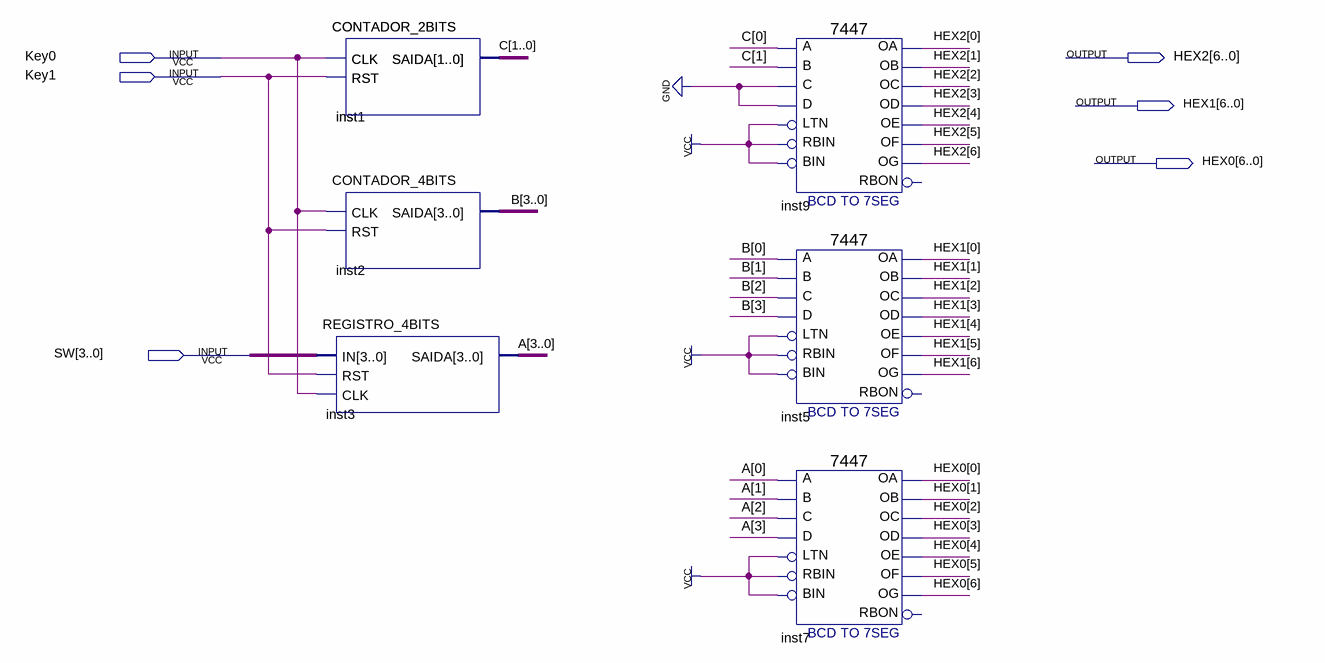
[diagram p0: schematic sheet]
// Quartus schematic TESTE_FINAL.bdf as structural Verilog: 7 symbols, 6 pins
module TESTE_FINAL (
  input  Key0,
  input  Key1,
  input  [3:0] SW,
  output [6:0] HEX2,
  output [6:0] HEX1,
  output [6:0] HEX0
);

  wire [1:0] C;
  wire [3:0] A, B;

  REGISTRO_4BITS inst3 (.IN(SW), .RST(Key1), .CLK(Key0), .SAIDA(A));
  CONTADOR_2BITS inst (.CLK(Key0), .RST(Key1), .SAIDA(C));
  CONTADOR_2BITS inst1 (.CLK(Key0), .RST(Key1), .SAIDA(C));
  CONTADOR_4BITS inst2 (.CLK(Key0), .RST(Key1), .SAIDA(B));
  \7447  inst9 (
    .LTN(1'b1), .B(C[1]), .C(1'b0), .D(1'b0), .RBIN(1'b1), .BIN(1'b1), .A(C[0]), .OB(HEX2[1]), .OC(HEX2[2]),
    .OE(HEX2[4]), .OD(HEX2[3]), .OF(HEX2[5]), .OG(HEX2[6]), .OA(HEX2[0]));  // open: RBON
  \7447  inst5 (
    .LTN(1'b1), .B(B[1]), .C(B[2]), .D(B[3]), .RBIN(1'b1), .BIN(1'b1), .A(B[0]), .OB(HEX1[1]), .OC(HEX1[2]),
    .OE(HEX1[4]), .OD(HEX1[3]), .OF(HEX1[5]), .OG(HEX1[6]), .OA(HEX1[0]));  // open: RBON
  \7447  inst7 (
    .LTN(1'b1), .B(A[1]), .C(A[2]), .D(A[3]), .RBIN(1'b1), .BIN(1'b1), .A(A[0]), .OB(HEX0[1]), .OC(HEX0[2]),
    .OE(HEX0[4]), .OD(HEX0[3]), .OF(HEX0[5]), .OG(HEX0[6]), .OA(HEX0[0]));  // open: RBON
endmodule
